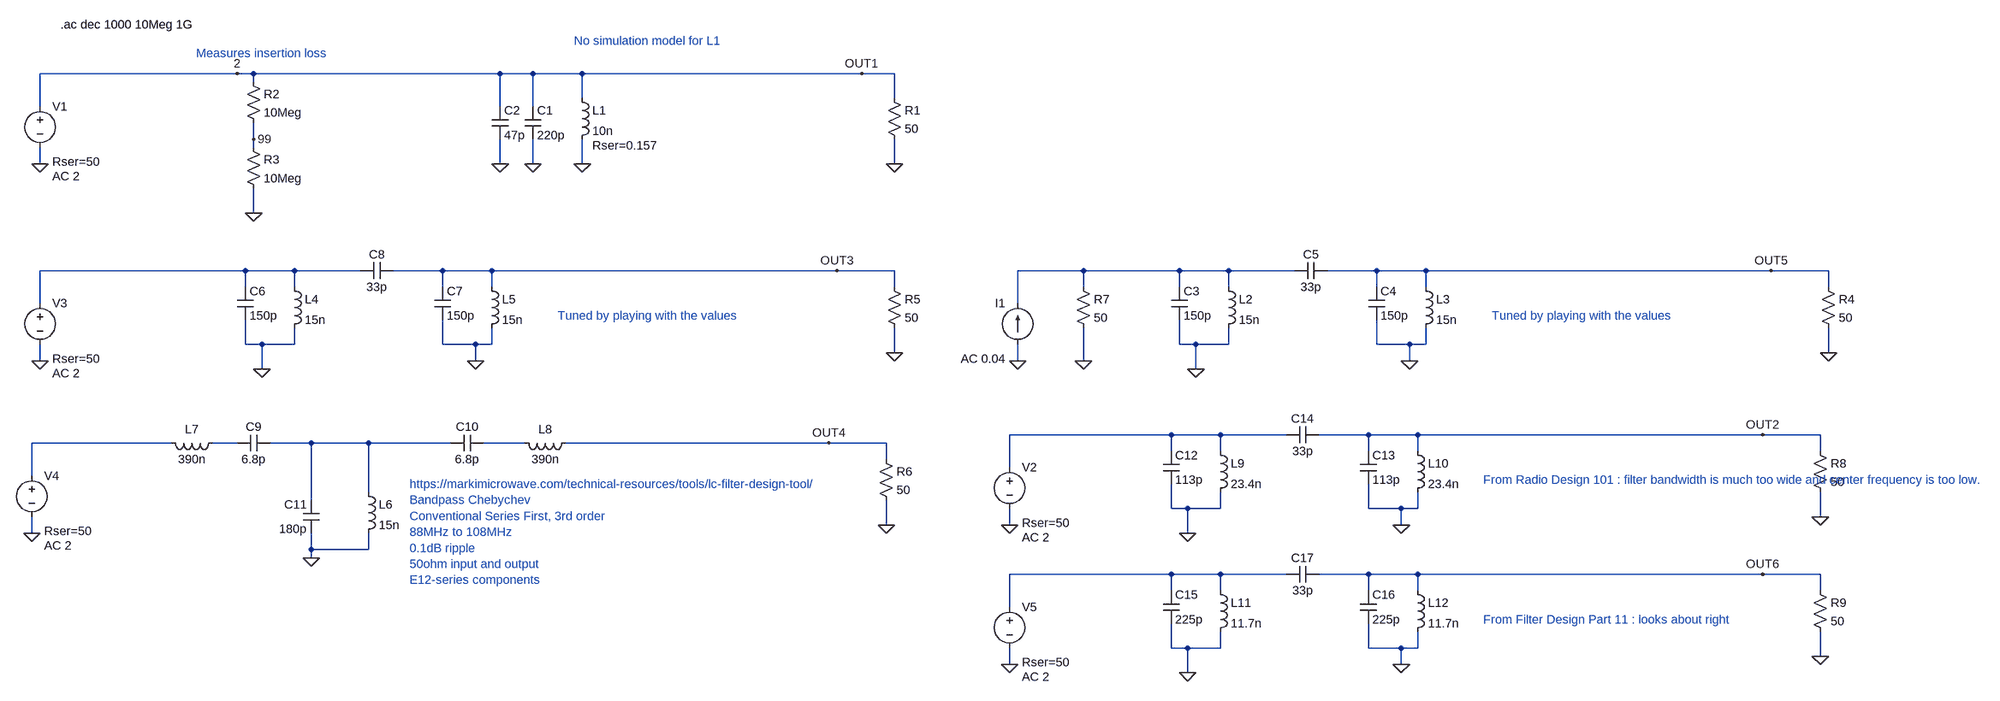
[diagram p0: schematic PreSelect_Filter.asc]
PreSelect_Filter.asc, the LTspice schematic file:
Version 4
SHEET 1 3192 1448
WIRE -384 80 -768 80
WIRE -352 80 -384 80
WIRE 128 80 -352 80
WIRE 192 80 128 80
WIRE 288 80 192 80
WIRE 832 80 288 80
WIRE 896 80 832 80
WIRE -352 96 -352 80
WIRE 288 128 288 80
WIRE 896 128 896 80
WIRE -768 144 -768 80
WIRE 128 144 128 80
WIRE 192 144 192 80
WIRE -352 208 -352 176
WIRE -352 224 -352 208
WIRE -768 256 -768 224
WIRE 128 256 128 208
WIRE 192 256 192 208
WIRE 288 256 288 208
WIRE 896 256 896 208
WIRE -352 352 -352 304
WIRE -368 464 -768 464
WIRE -272 464 -368 464
WIRE -144 464 -272 464
WIRE 16 464 -80 464
WIRE 112 464 16 464
WIRE 784 464 112 464
WIRE 896 464 784 464
WIRE 1264 464 1136 464
WIRE 1536 464 1264 464
WIRE 1632 464 1536 464
WIRE 1760 464 1632 464
WIRE 1920 464 1824 464
WIRE 2016 464 1920 464
WIRE 2688 464 2016 464
WIRE 2800 464 2688 464
WIRE -368 496 -368 464
WIRE -272 496 -272 464
WIRE 16 496 16 464
WIRE 112 496 112 464
WIRE 896 496 896 464
WIRE 1264 496 1264 464
WIRE 1536 496 1536 464
WIRE 1632 496 1632 464
WIRE 1920 496 1920 464
WIRE 2016 496 2016 464
WIRE 2800 496 2800 464
WIRE -768 528 -768 464
WIRE 1136 528 1136 464
WIRE -368 608 -368 560
WIRE -336 608 -368 608
WIRE -272 608 -272 576
WIRE -272 608 -336 608
WIRE 16 608 16 560
WIRE 80 608 16 608
WIRE 112 608 112 576
WIRE 112 608 80 608
WIRE 1536 608 1536 560
WIRE 1568 608 1536 608
WIRE 1632 608 1632 576
WIRE 1632 608 1568 608
WIRE 1920 608 1920 560
WIRE 1984 608 1920 608
WIRE 2016 608 2016 576
WIRE 2016 608 1984 608
WIRE 896 624 896 576
WIRE 2800 624 2800 576
WIRE -768 640 -768 608
WIRE 80 640 80 608
WIRE 1136 640 1136 608
WIRE 1264 640 1264 576
WIRE 1984 640 1984 608
WIRE -336 656 -336 608
WIRE 1568 656 1568 608
WIRE 1520 784 1120 784
WIRE 1616 784 1520 784
WIRE 1744 784 1616 784
WIRE 1904 784 1808 784
WIRE 2000 784 1904 784
WIRE 2672 784 2000 784
WIRE 2784 784 2672 784
WIRE -512 800 -784 800
WIRE -384 800 -432 800
WIRE -240 800 -320 800
WIRE -128 800 -240 800
WIRE 32 800 -128 800
WIRE 176 800 96 800
WIRE 768 800 256 800
WIRE 880 800 768 800
WIRE 1520 816 1520 784
WIRE 1616 816 1616 784
WIRE 1904 816 1904 784
WIRE 2000 816 2000 784
WIRE 2784 816 2784 784
WIRE 880 832 880 800
WIRE 1120 848 1120 784
WIRE -784 864 -784 800
WIRE -128 896 -128 800
WIRE -240 912 -240 800
WIRE 1520 928 1520 880
WIRE 1552 928 1520 928
WIRE 1616 928 1616 896
WIRE 1616 928 1552 928
WIRE 1904 928 1904 880
WIRE 1968 928 1904 928
WIRE 2000 928 2000 896
WIRE 2000 928 1968 928
WIRE 2784 944 2784 896
WIRE 880 960 880 912
WIRE 1120 960 1120 928
WIRE 1968 960 1968 928
WIRE -784 976 -784 944
WIRE 1552 976 1552 928
WIRE -240 1008 -240 976
WIRE -128 1008 -128 976
WIRE -128 1008 -240 1008
WIRE -240 1024 -240 1008
WIRE 1520 1056 1120 1056
WIRE 1616 1056 1520 1056
WIRE 1744 1056 1616 1056
WIRE 1904 1056 1808 1056
WIRE 2000 1056 1904 1056
WIRE 2672 1056 2000 1056
WIRE 2784 1056 2672 1056
WIRE 1520 1088 1520 1056
WIRE 1616 1088 1616 1056
WIRE 1904 1088 1904 1056
WIRE 2000 1088 2000 1056
WIRE 2784 1088 2784 1056
WIRE 1120 1120 1120 1056
WIRE 1520 1200 1520 1152
WIRE 1552 1200 1520 1200
WIRE 1616 1200 1616 1168
WIRE 1616 1200 1552 1200
WIRE 1904 1200 1904 1152
WIRE 1968 1200 1904 1200
WIRE 2000 1200 2000 1168
WIRE 2000 1200 1968 1200
WIRE 2784 1216 2784 1168
WIRE 1120 1232 1120 1200
WIRE 1968 1232 1968 1200
WIRE 1552 1248 1552 1200
FLAG -768 256 0
FLAG 192 256 0
FLAG 288 256 0
FLAG 896 256 0
FLAG 128 256 0
FLAG 832 80 OUT1
FLAG -384 80 2
FLAG -352 208 99
FLAG -352 352 0
FLAG -768 640 0
FLAG -336 656 0
FLAG 80 640 0
FLAG 896 624 0
FLAG 784 464 OUT3
FLAG -784 976 0
FLAG 880 960 0
FLAG 768 800 OUT4
FLAG -240 1024 0
FLAG 1136 640 0
FLAG 1568 656 0
FLAG 1984 640 0
FLAG 2800 624 0
FLAG 1264 640 0
FLAG 2688 464 OUT5
FLAG 1120 960 0
FLAG 1552 976 0
FLAG 1968 960 0
FLAG 2784 944 0
FLAG 2672 784 OUT2
FLAG 1120 1232 0
FLAG 1552 1248 0
FLAG 1968 1232 0
FLAG 2784 1216 0
FLAG 2672 1056 OUT6
SYMBOL voltage -768 128 R0
WINDOW 123 24 152 Left 2
WINDOW 39 24 124 Left 2
SYMATTR Value2 AC 2
SYMATTR SpiceLine Rser=50
SYMATTR InstName V1
SYMATTR Value ""
SYMBOL cap 176 144 R0
SYMATTR InstName C1
SYMATTR Value 220p
SYMATTR SpiceLine V=50 Irms=0 Rser=0.1207 Lser=611p mfg="Würth Elektronik" pn="885012006059 WCAP-CSGP 0603" type="NP0"
SYMBOL ind 272 112 R0
WINDOW 39 36 108 Left 2
SYMATTR SpiceLine Rser=0.157
SYMATTR InstName L1
SYMATTR Value 10n
SYMBOL res 880 112 R0
SYMATTR InstName R1
SYMATTR Value 50
SYMBOL cap 112 144 R0
SYMATTR InstName C2
SYMATTR Value 47p
SYMATTR SpiceLine V=50 Irms=0 Rser=0.2909 Lser=403p mfg="Würth Elektronik" pn="885012006055 WCAP-CSGP 0603" type="NP0"
SYMBOL res -368 80 R0
SYMATTR InstName R2
SYMATTR Value 10Meg
SYMBOL res -368 208 R0
SYMATTR InstName R3
SYMATTR Value 10Meg
SYMBOL voltage -768 512 R0
WINDOW 123 24 152 Left 2
WINDOW 39 24 124 Left 2
SYMATTR Value2 AC 2
SYMATTR SpiceLine Rser=50
SYMATTR InstName V3
SYMATTR Value ""
SYMBOL cap -384 496 R0
SYMATTR InstName C6
SYMATTR Value 150p
SYMBOL cap 0 496 R0
SYMATTR InstName C7
SYMATTR Value 150p
SYMBOL ind -288 480 R0
SYMATTR InstName L4
SYMATTR Value 15n
SYMBOL ind 96 480 R0
SYMATTR InstName L5
SYMATTR Value 15n
SYMBOL cap -80 448 R90
WINDOW 0 0 32 VBottom 2
WINDOW 3 32 32 VTop 2
SYMATTR InstName C8
SYMATTR Value 33p
SYMBOL res 880 480 R0
SYMATTR InstName R5
SYMATTR Value 50
SYMBOL voltage -784 848 R0
WINDOW 123 24 152 Left 2
WINDOW 39 24 124 Left 2
SYMATTR Value2 AC 2
SYMATTR SpiceLine Rser=50
SYMATTR InstName V4
SYMATTR Value ""
SYMBOL res 864 816 R0
SYMATTR InstName R6
SYMATTR Value 50
SYMBOL cap -320 784 R90
WINDOW 0 0 32 VBottom 2
WINDOW 3 32 32 VTop 2
SYMATTR InstName C9
SYMATTR Value 6.8p
SYMBOL cap 96 784 R90
WINDOW 0 0 32 VBottom 2
WINDOW 3 32 32 VTop 2
SYMATTR InstName C10
SYMATTR Value 6.8p
SYMBOL cap -224 976 R180
WINDOW 0 24 56 Left 2
WINDOW 3 24 8 Left 2
SYMATTR InstName C11
SYMATTR Value 180p
SYMBOL ind -144 880 R0
SYMATTR InstName L6
SYMATTR Value 15n
SYMBOL ind -416 784 R90
WINDOW 0 5 56 VBottom 2
WINDOW 3 32 56 VTop 2
SYMATTR InstName L7
SYMATTR Value 390n
SYMBOL ind 272 784 R90
WINDOW 0 5 56 VBottom 2
WINDOW 3 32 56 VTop 2
SYMATTR InstName L8
SYMATTR Value 390n
SYMBOL cap 1520 496 R0
SYMATTR InstName C3
SYMATTR Value 150p
SYMBOL cap 1904 496 R0
SYMATTR InstName C4
SYMATTR Value 150p
SYMBOL ind 1616 480 R0
SYMATTR InstName L2
SYMATTR Value 15n
SYMBOL ind 2000 480 R0
SYMATTR InstName L3
SYMATTR Value 15n
SYMBOL cap 1824 448 R90
WINDOW 0 0 32 VBottom 2
WINDOW 3 32 32 VTop 2
SYMATTR InstName C5
SYMATTR Value 33p
SYMBOL res 2784 480 R0
SYMATTR InstName R4
SYMATTR Value 50
SYMBOL current 1136 608 R180
WINDOW 0 24 80 Left 2
WINDOW 3 24 0 Left 2
WINDOW 123 24 -28 Left 2
WINDOW 39 0 0 Left 0
SYMATTR InstName I1
SYMATTR Value ""
SYMATTR Value2 AC 0.04
SYMBOL res 1248 480 R0
SYMATTR InstName R7
SYMATTR Value 50
SYMBOL voltage 1120 832 R0
WINDOW 123 24 152 Left 2
WINDOW 39 24 124 Left 2
SYMATTR Value2 AC 2
SYMATTR SpiceLine Rser=50
SYMATTR InstName V2
SYMATTR Value ""
SYMBOL cap 1504 816 R0
SYMATTR InstName C12
SYMATTR Value 113p
SYMBOL cap 1888 816 R0
SYMATTR InstName C13
SYMATTR Value 113p
SYMBOL ind 1600 800 R0
SYMATTR InstName L9
SYMATTR Value 23.4n
SYMBOL ind 1984 800 R0
SYMATTR InstName L10
SYMATTR Value 23.4n
SYMBOL cap 1808 768 R90
WINDOW 0 0 32 VBottom 2
WINDOW 3 32 32 VTop 2
SYMATTR InstName C14
SYMATTR Value 33p
SYMBOL res 2768 800 R0
SYMATTR InstName R8
SYMATTR Value 50
SYMBOL voltage 1120 1104 R0
WINDOW 123 24 152 Left 2
WINDOW 39 24 124 Left 2
SYMATTR Value2 AC 2
SYMATTR SpiceLine Rser=50
SYMATTR InstName V5
SYMATTR Value ""
SYMBOL cap 1504 1088 R0
SYMATTR InstName C15
SYMATTR Value 225p
SYMBOL cap 1888 1088 R0
SYMATTR InstName C16
SYMATTR Value 225p
SYMBOL ind 1600 1072 R0
SYMATTR InstName L11
SYMATTR Value 11.7n
SYMBOL ind 1984 1072 R0
SYMATTR InstName L12
SYMATTR Value 11.7n
SYMBOL cap 1808 1040 R90
WINDOW 0 0 32 VBottom 2
WINDOW 3 32 32 VTop 2
SYMATTR InstName C17
SYMATTR Value 33p
SYMBOL res 2768 1072 R0
SYMATTR InstName R9
SYMATTR Value 50
TEXT -728 -16 Left 2 !.ac dec 1000 10Meg 1G
TEXT 272 16 Left 2 ;No simulation model for L1
TEXT -464 40 Left 2 ;Measures insertion loss
TEXT -48 880 Left 2 ;https://markimicrowave.com/technical-resources/tools/lc-filter-design-tool/\nBandpass Chebychev\nConventional Series First, 3rd order\n88MHz to 108MHz\n0.1dB ripple\n50ohm input and output\nE12-series components
TEXT 240 552 Left 2 ;Tuned by playing with the values
TEXT 2144 552 Left 2 ;Tuned by playing with the values
TEXT 2128 872 Left 2 ;From Radio Design 101 : filter bandwidth is much too wide and center frequency is too low.
TEXT 2128 1144 Left 2 ;From Filter Design Part 11 : looks about right

The netlist it stands for:
* PreSelect_Filter.asc
V1 2 0 AC 2 Rser=50
C1 2 0 220p V=50 Irms=0 Rser=0.1207 Lser=611p mfg="Würth Elektronik" pn="885012006059 WCAP-CSGP 0603" type="NP0"
L1 2 0 10n Rser=0.157
R1 2 0 50
C2 2 0 47p V=50 Irms=0 Rser=0.2909 Lser=403p mfg="Würth Elektronik" pn="885012006055 WCAP-CSGP 0603" type="NP0"
R2 2 99 10Meg
R3 99 0 10Meg
V3 N001 0 AC 2 Rser=50
C6 N001 0 150p
C7 OUT3 0 150p
L4 N001 0 15n
L5 OUT3 0 15n
C8 OUT3 N001 33p
R5 OUT3 0 50
V4 N004 0 AC 2 Rser=50
R6 OUT4 0 50
C9 N006 N005 6.8p
C10 N007 N006 6.8p
C11 0 N006 180p
L6 N006 0 15n
L7 N005 N004 390n
L8 OUT4 N007 390n
C3 N002 0 150p
C4 OUT5 0 150p
L2 N002 0 15n
L3 OUT5 0 15n
C5 OUT5 N002 33p
R4 OUT5 0 50
I1 0 N002 AC 0.04
R7 N002 0 50
V2 N003 0 AC 2 Rser=50
C12 N003 0 113p
C13 OUT2 0 113p
L9 N003 0 23.4n
L10 OUT2 0 23.4n
C14 OUT2 N003 33p
R8 OUT2 0 50
V5 N008 0 AC 2 Rser=50
C15 N008 0 225p
C16 OUT6 0 225p
L11 N008 0 11.7n
L12 OUT6 0 11.7n
C17 OUT6 N008 33p
R9 OUT6 0 50
.ac dec 1000 10Meg 1G
* No simulation model for L1
* Measures insertion loss
* https://markimicrowave.com/technical-resources/tools/lc-filter-design-tool/
* Bandpass Chebychev
* Conventional Series First, 3rd order
* 88MHz to 108MHz
* 0.1dB ripple
* 50ohm input and output
* E12-series components
* Tuned by playing with the values
* Tuned by playing with the values
* From Radio Design 101 : filter bandwidth is much too wide and center frequency is too low.
* From Filter Design Part 11 : looks about right
.backanno
.end